# Altium schematic sheet Qunyin_mmWave_mainIOs.SchDoc: mmWave_iwr6843aop
size 457 x 292 mm; DrawnBy: Wxd; Organization: Shanghai Qunyin; Address1: Xianxia Rd 601; Address2: Changning district; Address3: Shanghai; DocumentNumber: 1; SheetNumber: 1; SheetTotal: 5
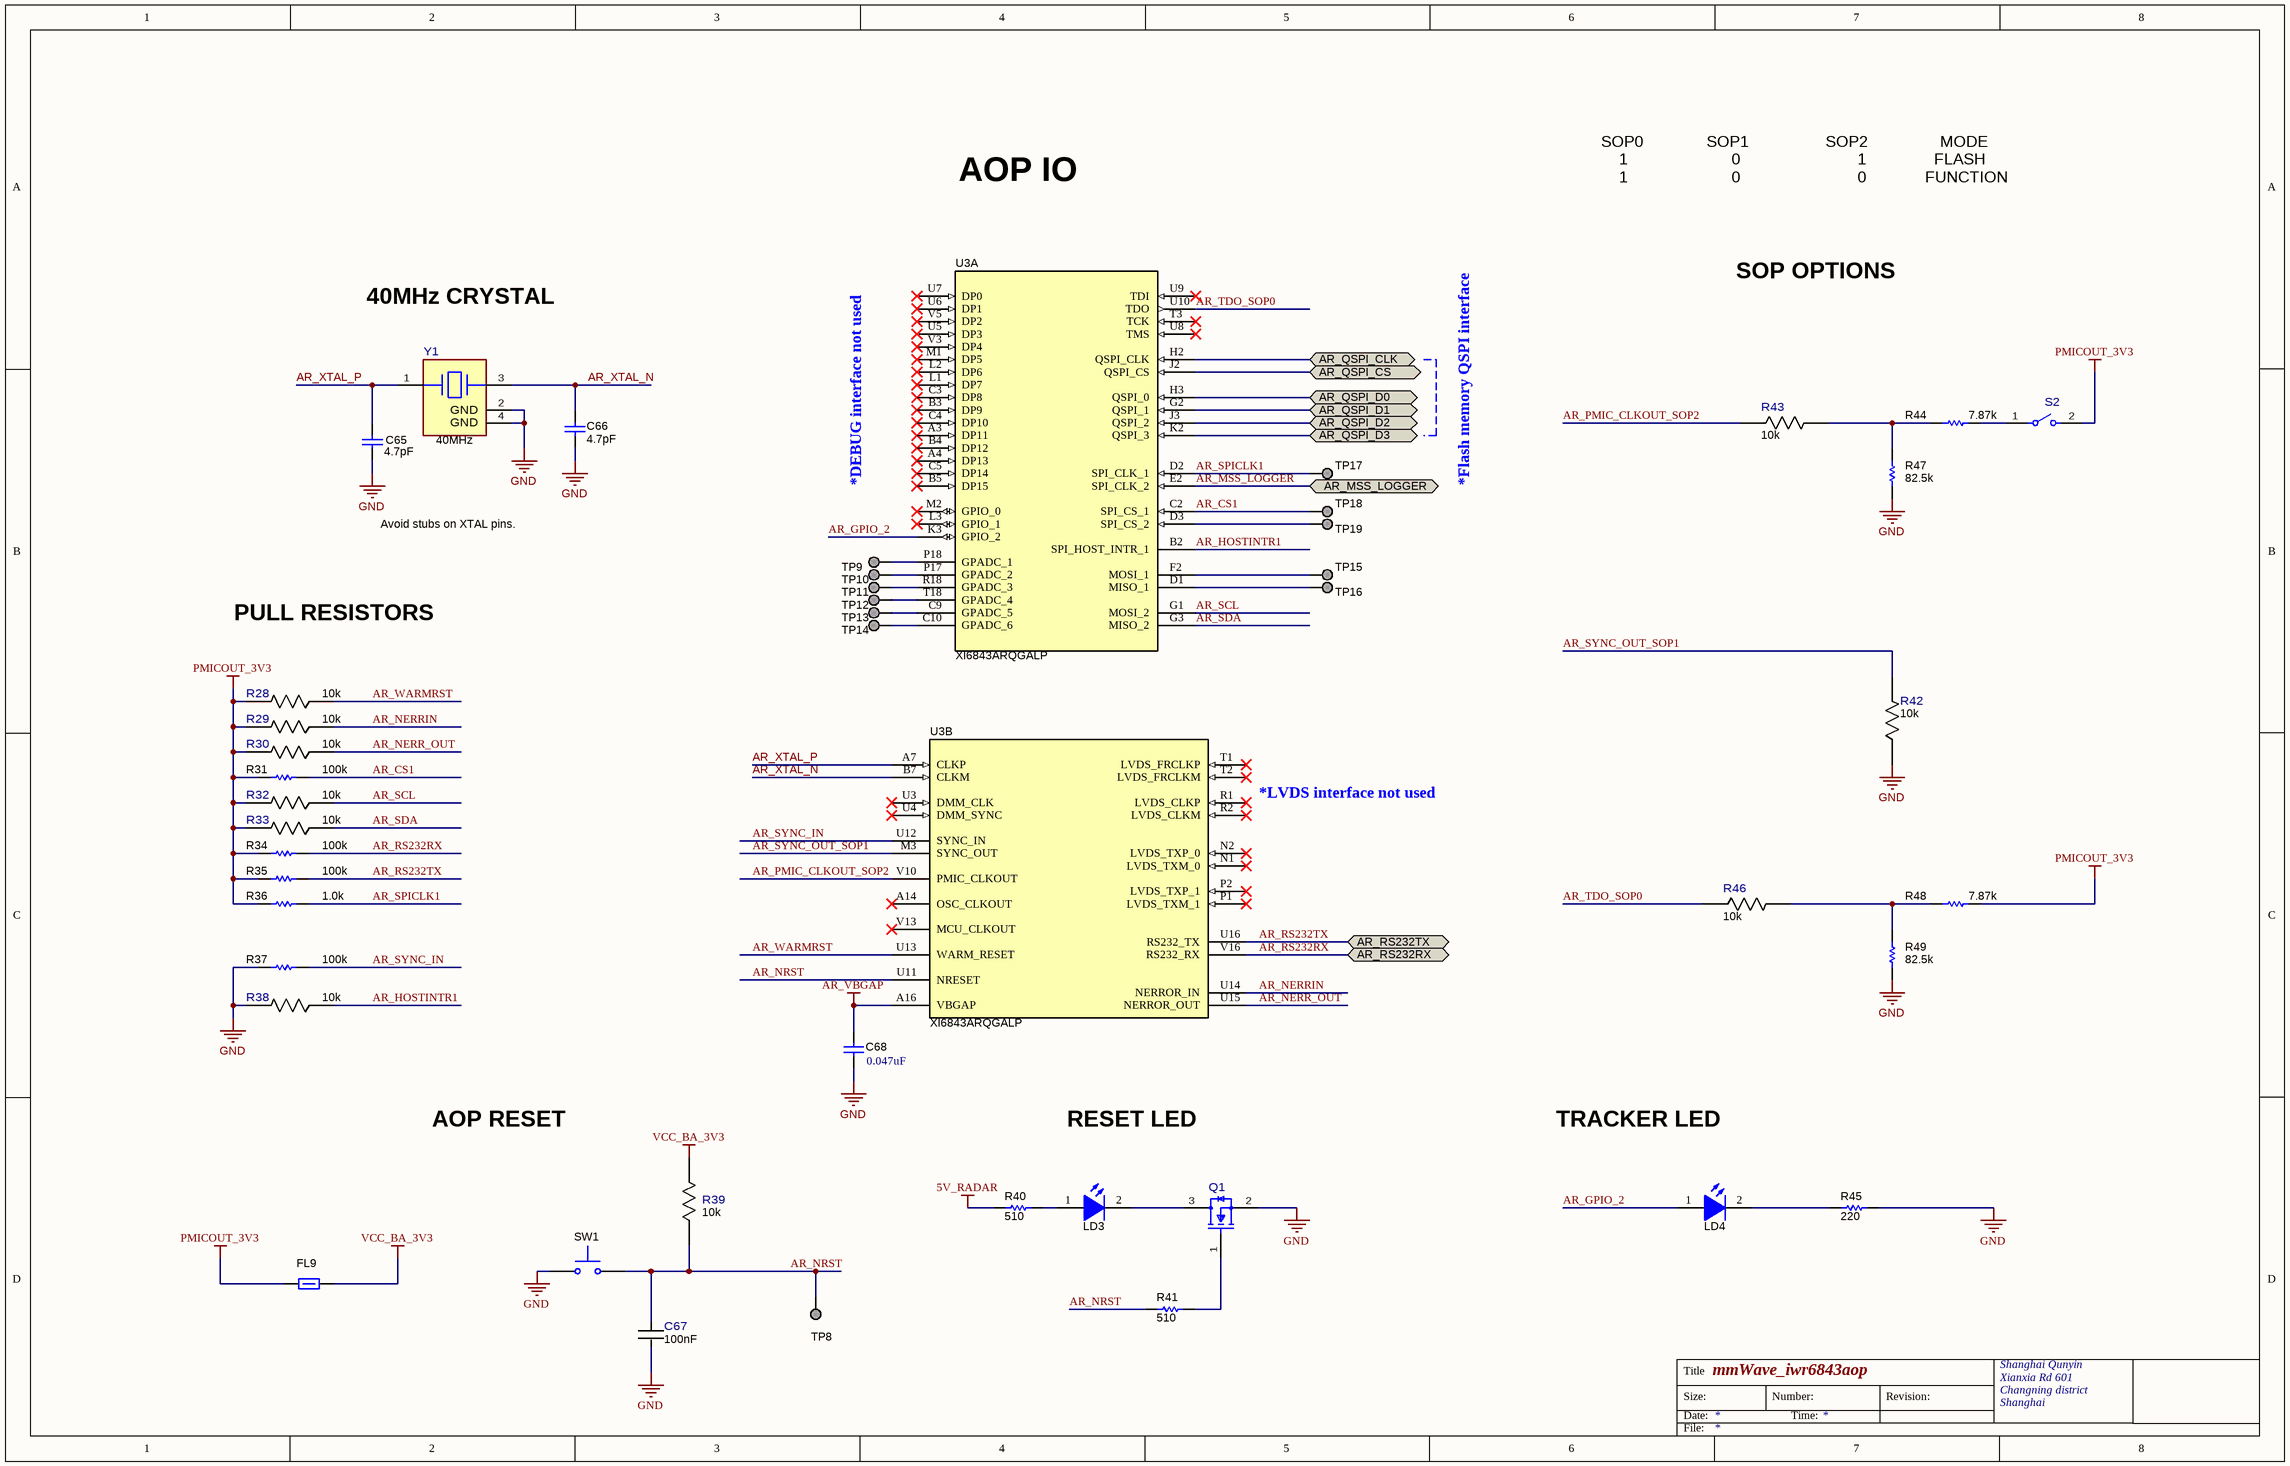
[diagram p0: Qunyin_mmWave_mainIOs.SchDoc]

## Parts
C65  value 4.7pF  [0201_033L]  (hidden comment: GRM0335C1H4R7BA01D)
C66  value 4.7pF  [0201_033L]  (hidden comment: GRM0335C1H4R7BA01D)
C67  Cap_F: 100nF  [FP-GRM033R6YA104KE14D_0201 (0603 Metric)-IPC_C]  (hidden comment: GRM033R6YA104KE14D)
C68  ValueDisplayed: 0.047uF  [0201_033L]  (hidden comment: GRM033R61C473KE84D)
FL9  BLM15PD300SZ1D  [0402L]  (value not drawn)
LD3  APHHS1005CGCK  [APHHS1005_Green]  (value not drawn)
LD4  APHHS1005CGCK  [APHHS1005_Green]  (value not drawn)
Q1  BSS123-7-F  [FP-BSS123-7-F_SOT23-IPC_C]  (value not drawn)
R28  Res_ohm: 10k  [FP-RR0306P-103-D_0201-IPC_C]  (hidden comment: RR0306P-103-D)
R29  Res_ohm: 10k  [FP-RR0306P-103-D_0201-IPC_C]  (hidden comment: RR0306P-103-D)
R30  Res_ohm: 10k  [FP-RR0306P-103-D_0201-IPC_C]  (hidden comment: RR0306P-103-D)
R31  value 100k  [0201L]  (hidden comment: CRCW0201100KFKED)
R32  Res_ohm: 10k  [FP-RR0306P-103-D_0201-IPC_C]  (hidden comment: RR0306P-103-D)
R33  Res_ohm: 10k  [FP-RR0306P-103-D_0201-IPC_C]  (hidden comment: RR0306P-103-D)
R34  value 100k  [0201L]  (hidden comment: CRCW0201100KFKED)
R35  value 100k  [0201L]  (hidden comment: CRCW0201100KFKED)
R36  value 1.0k  [0201L]  (hidden comment: RC0201JR-071KL)
R37  value 100k  [0201L]  (hidden comment: CRCW0201100KFKED)
R38  Res_ohm: 10k  [FP-RR0306P-103-D_0201-IPC_C]  (hidden comment: RR0306P-103-D)
R39  Res_ohm: 10k  [FP-RR0306P-103-D_0201-IPC_C]  (hidden comment: RR0306P-103-D)
R40  value 510  [0201L]  (hidden comment: RC0201JR-07510RL)
R41  value 510  [0201L]  (hidden comment: RC0201JR-07510RL)
R42  Res_ohm: 10k  [FP-RR0306P-103-D_0201-IPC_C]  (hidden comment: RR0306P-103-D)
R43  Res_ohm: 10k  [FP-RR0306P-103-D_0201-IPC_C]  (hidden comment: RR0306P-103-D)
R44  value 7.87k  [0201L]  (hidden comment: RC0201FR-077K87L)
R45  value 220  [0201L]  (hidden comment: RC0201JR-07220RL)
R46  Res_ohm: 10k  [FP-RR0306P-103-D_0201-IPC_C]  (hidden comment: RR0306P-103-D)
R47  value 82.5k  [0201L]  (hidden comment: RC0201FR-0782K5L)
R48  value 7.87k  [0201L]  (hidden comment: RC0201FR-077K87L)
R49  value 82.5k  [0201L]  (hidden comment: RC0201FR-0782K5L)
S2  CHS-01TA  [FP-CHS-01TA_SMT_SW_5MM4_2MM5-MFG]  (value not drawn)
SW1  B3U-1000P  [SW_B3U-1000P]  (value not drawn)
TP8  TESTPOINT  [TP_25MIL-SMT]  (value not drawn)  (no BOM)
TP9  TESTPOINT  [TP_25MIL-SMT]  (value not drawn)  (no BOM)
TP10  TESTPOINT  [TP_25MIL-SMT]  (value not drawn)  (no BOM)
TP11  TESTPOINT  [TP_25MIL-SMT]  (value not drawn)  (no BOM)
TP12  TESTPOINT  [TP_25MIL-SMT]  (value not drawn)  (no BOM)
TP13  TESTPOINT  [TP_25MIL-SMT]  (value not drawn)  (no BOM)
TP14  TESTPOINT  [TP_25MIL-SMT]  (value not drawn)  (no BOM)
TP15  TESTPOINT  [TP_25MIL-SMT]  (value not drawn)  (no BOM)
TP16  TESTPOINT  [TP_25MIL-SMT]  (value not drawn)  (no BOM)
TP17  TESTPOINT  [TP_25MIL-SMT]  (value not drawn)  (no BOM)
TP18  TESTPOINT  [TP_25MIL-SMT]  (value not drawn)  (no BOM)
TP19  TESTPOINT  [TP_25MIL-SMT]  (value not drawn)  (no BOM)
U3  XI6843ARQGALP  [ALP0180A]  (parts A,B of 4)
Y1  Frequency_Fixed: 40MHz  [FP-CX2016DB40000D0FLJCC_SMT_2MM0_1MM6-MFG]  (hidden comment: CX2016DB40000D0FLJCC)

## Ports
AR_MSS_LOGGER (bidir), AR_QSPI_CLK (bidir), AR_QSPI_CS (bidir), AR_QSPI_D0 (bidir), AR_QSPI_D1 (bidir), AR_QSPI_D2 (bidir), AR_QSPI_D3 (bidir), AR_RS232RX (bidir), AR_RS232TX (bidir)

## Nets
5V_RADAR: R40.1
AR_VBGAP: C68.1 U3.A16(VBGAP)
GND: C65.1 C66.1 C67.2 C68.2 Q1.2(S) R37.1 R38.2 R42.1 R45.1 R47.1 R49.1 SW1.2 Y1.2(GND) Y1.4(GND)
PMICOUT_3V3: FL9.1 R28.2 R29.2 R30.2 R31.1 R32.2 R33.2 R34.1 R35.1 R36.1 R48.1 S2.2
VCC_BA_3V3: FL9.2 R39.2
AR_CS1: R31.2 TP18.1 U3.C2(SPI_CS_1)
AR_GPIO_2: LD4.1(A) U3.K3(GPIO_2)
AR_HOSTINTR1: R38.1 U3.B2(SPI_HOST_INTR_1)
AR_MSS_LOGGER: U3.E2(SPI_CLK_2) ; port AR_MSS_LOGGER
AR_NERR_OUT: R30.1 U3.U15(NERROR_OUT)
AR_NERRIN: R29.1 U3.U14(NERROR_IN)
AR_NRST: C67.1 R39.1 R41.1 SW1.1 TP8.1 U3.U11(NRESET)
AR_PMIC_CLKOUT_SOP2: R43.1 U3.V10(PMIC_CLKOUT)
AR_QSPI_CLK: U3.H2(QSPI_CLK) ; port AR_QSPI_CLK
AR_QSPI_CS: U3.J2(QSPI_CS) ; port AR_QSPI_CS
AR_QSPI_D0: U3.H3(QSPI_0) ; port AR_QSPI_D0
AR_QSPI_D1: U3.G2(QSPI_1) ; port AR_QSPI_D1
AR_QSPI_D2: U3.J3(QSPI_2) ; port AR_QSPI_D2
AR_QSPI_D3: U3.K2(QSPI_3) ; port AR_QSPI_D3
AR_RS232RX: R34.2 U3.V16(RS232_RX) ; port AR_RS232RX
AR_RS232TX: R35.2 U3.U16(RS232_TX) ; port AR_RS232TX
AR_SCL: R32.1 U3.G1(MOSI_2)
AR_SDA: R33.1 U3.G3(MISO_2)
AR_SPICLK1: R36.2 TP17.1 U3.D2(SPI_CLK_1)
AR_SYNC_IN: R37.2 U3.U12(SYNC_IN)
AR_SYNC_OUT_SOP1: R42.2 U3.M3(SYNC_OUT)
AR_TDO_SOP0: R46.1 U3.U10(TDO)
AR_WARMRST: R28.1 U3.U13(WARM_RESET)
AR_XTAL_N: C66.2 U3.B7(CLKM) Y1.3
AR_XTAL_P: C65.2 U3.A7(CLKP) Y1.1
NetLD3_1: LD3.1(A) R40.2
NetLD3_2: LD3.2(K) Q1.3(D)
NetLD4_2: LD4.2(K) R45.2
NetQ1_1: Q1.1(G) R41.2
NetR43_2: R43.2 R44.2 R47.2
NetR44_1: R44.1 S2.1
NetR46_2: R46.2 R48.2 R49.2
NetTP9_1: TP9.1 U3.P18(GPADC_1)
NetTP10_1: TP10.1 U3.P17(GPADC_2)
NetTP11_1: TP11.1 U3.R18(GPADC_3)
NetTP12_1: TP12.1 U3.T18(GPADC_4)
NetTP13_1: TP13.1 U3.C9(GPADC_5)
NetTP14_1: TP14.1 U3.C10(GPADC_6)
NetTP15_1: TP15.1 U3.F2(MOSI_1)
NetTP16_1: TP16.1 U3.D1(MISO_1)
NetTP19_1: TP19.1 U3.D3(SPI_CS_2)

Not connected (* = marked no-connect by the designer): U3 A3(DP11)* A4(DP13)* A14(OSC_CLKOUT)* B3(DP9)* B4(DP12)* B5(DP15)* C3(DP8)* C4(DP10)* C5(DP14)* L1(DP7)* L2(DP6)* L3(GPIO_1)* M1(DP5)* M2(GPIO_0)* N1(LVDS_TXM_0)* N2(LVDS_TXP_0)* P1(LVDS_TXM_1)* P2(LVDS_TXP_1)* R1(LVDS_CLKP)* R2(LVDS_CLKM)* T1(LVDS_FRCLKP)* T2(LVDS_FRCLKM)* T3(TCK)* U3(DMM_CLK)* U4(DMM_SYNC)* U5(DP3)* U6(DP1)* U7(DP0)* U8(TMS)* U9(TDI)* V3(DP4)* V5(DP2)* V13(MCU_CLKOUT)*

## Notes on the sheet
- AOP IO
- SOP0              SOP1                 SOP2                MODE
  1                       0                          1               FLASH
  1                       0                          0             FUNCTION
- SOP OPTIONS
- 40MHz CRYSTAL
- Avoid stubs on XTAL pins.
- *DEBUG interface not used
- *Flash memory QSPI interface
- PULL RESISTORS
- *LVDS interface not used
- AOP RESET
- RESET LED
- TRACKER LED
- Title
- Size:
- Date:
- Number:
- Time:
- Revision:
- File:

## Library data of the parts
C65 C66 = CMP-0080076-1: CAP, CERM, 4.7 pF, 50 V,+/- 3%, C0G/NP0, 0201; Manufacturer: MuRata; AEC Category: Q200; AEC Qualified: N; Cap_Case: 0201; SizeArea_mm2: 0.18; SizeAreaWB_mm2: 2.08; SizeX_mm: 0.6; SizeY_mm: 0.3; SizeZ_mm: 0.33; TaMax_C: 125°C; TaMin_C: -55°C; U/M: EA; Value2: 50V; RoHS: Y; AEC Grade: N/A; Cap_F: 4.7pF; ComponentLink1Description: Datasheet link; ComponentLink1URL: https://search.murata.co.jp/Ceramy/image/img/A01X/G101/ENG/GRM0335C1H4R7BA01-01A.pdf; CompType: Capacitor; MountType: SMT; PackageReference: 0201; PartNumber: GRM0335C1H4R7BA01D; Polarized: N; Supplier 1: Digi-Key; Supplier 2: Mouser; Supplier Part Number 1: 490-11332-1-ND; Supplier Part Number 2: 81-GRM0335C1H4R7BA1D; Technology: Ceramic; TempCo: C0G/NP0; Tolerance_%: 3%; ValueDisplayed: 4.7pF; VDC_V: 50V
C67 = CMP-0086440-1: Cap Ceramic 0.1uF 35V X5R 10% Pad SMD 0201 85C T/R; Manufacturer: Murata Electronics North America; AEC Qualified: No; SizeZ_mm: 0.33mm; Symbol Name: SYM-GRM033R6YA104KE14D; TempCo: 15%; RoHS: TRUE; ComponentLink1Description: Datasheet; ComponentLink1URL: https://search.murata.co.jp/Ceramy/image/img/A01X/G101/ENG/GRM033R6YA104KE14-01.pdf; PackageReference: 0201 (0603 Metric); PartNumber: GRM033R6YA104KE14D; Tolerance_%: 10%; VDC_V: 35V
C68 = CMP-0009718-2: CAP, CERM, 0.047 uF, 16 V, +/- 10%, X5R, 0201; Manufacturer: MuRata; TaMin_C: -55°C; Polarized: N; SizeAreaWB_mm2: 2.08; Value1: Unknown; U/M: EA; TaMax_C: 85°C; SizeZ_mm: 0.33; SizeX_mm: 0.6; SizeY_mm: 0.3; Cap_Case: 0201; Value2: 16V; SizeArea_mm2: 0.18; Cap_F: 47nF; AEC Category: Q200; Supplier Part Number 2: 81-GRM033R61C473KE4D; Publisher: Texas Instruments; Supplier 2: Mouser; TempCo: X5R; Published: 2008-06-19; RoHS: Y; MountType: SMT; Value: 0.047uF; Supplier 1: Digi-Key; PackageReference: 0201; Tolerance_%: 10%; CompType: Capacitor; LatestRevisionDate: 2017-03-09; PartNumber: GRM033R61C473KE84D; AEC Qualified: N; VDC_V: 16V; ComponentLink1Description: Datasheet link; AEC Grade: N/A; Supplier Part Number 1: 490-7227-1-ND; Technology: Ceramic; ComponentLink1URL: http://search.murata.co.jp/Ceramy/image/img/A01X/G101/ENG/GRM033R61C473KE84-01.pdf
FL9 = CMP-0078934-1: Inductor, Ferrite Bead, Ferrite, 2.2 A, 0.035 ohm, AEC-Q200 Grade 1, SMD; Manufacturer: MuRata; AEC Category: Q200; AEC Grade: 1; AEC Qualified: Y; DCR_ohm: 0.035; Imax_A: 2.2A; SizeArea_mm2: 0.5; SizeAreaWB_mm2: 3; SizeZ_mm: 0.6; RoHS: Y; ComponentLink1Description: Datasheet link; ComponentLink1URL: https://www.murata.com/en-us/products/productdata/8796748677150/QNFA9118.pdf; CompType: Inductor; LatestRevisionDate: 2017-12-07; Material: Ferrite; MountType: SMT; PackageReference: 0402; PartNumber: BLM15PD300SZ1D; Published: 2008-06-26; Publisher: Texas Instruments; SizeX_mm: 1; SizeY_mm: 0.5; Supplier 1: Digi-Key; Supplier 2: Mouser; Supplier Part Number 1: 490-16506-1-ND; Supplier Part Number 2: 81-BLM15PD300SZ1D; Technology: Ferrite Bead; Value1: 0.035 ohm; Value2: 2.2A
LD3 LD4 = CMP-0067682-2: LED, Green, SMD; Manufacturer: Kingbright; Angle: 120.0; Power_TotalModule: 75mW; SizeZ_mm: 0.6; Vf_V: 2.1V; Vr_V: 5V; Io_A: 20mA; Ir_A: 10µA; SizeArea_mm2: 0.5; SizeAreaWB_mm2: 3.0; SizeX_mm: 1.0; Tjmax_C: 85°C; Value1: 0.075W; RoHS: Y; Color: Green; ComponentLink1Description: Datasheet link; ComponentLink1URL: http://www.kingbrightusa.com/images/catalog/SPEC/APHHS1005CGCK.pdf; PackageReference: 0402; PartNumber: APHHS1005CGCK; CompType: LED; MountType: SMT; SizeY_mm: 0.5; Type: ?; Value2: 2.1V; Value: Green
Q1 = CMP-0087176-1: MOSFET N-CH 100V 170MA SOT23-3; Manufacturer: Diodes Incorporated; AEC Qualified: No; ChMode: False; Rdson45_ohm: 6; SizeZ_mm: 1.1mm; Vgs_V: 20V; RoHS: TRUE; ComponentLink1Description: Datasheet; ComponentLink1URL: https://www.diodes.com/assets/Datasheets/ds30366.pdf; IdsMax_A: 170mA; PackageReference: SOT23; PartNumber: BSS123-7-F; Symbol Name: SYM-BSS123-7-F; VdsMax_V: 100V
R28-R30 R32 R33 R38 R39 R42 R43 R46 = CMP-0088002-1: 10 kOhms ±0.5% 0.05W, 1/20W Chip Resistor 0201 (0603 Metric)  Thin Film; Manufacturer: Susumu; AEC Qualified: No; Power_W: 50mW; SizeZ_mm: 0.26mm; Symbol Name: SYM-RR0306P-103-D; TempCo: 25ppm/°C; VDC_V: 15V; RoHS: TRUE; ComponentLink1Description: Datasheet; ComponentLink1URL: https://www.susumu.co.jp/common/pdf/n_catalog_partition05_en.pdf; PackageReference: 0201; PartNumber: RR0306P-103-D; Technology: Thin Film; Tolerance_%: 0.5%
R31 R34 R35 R37 = CMP-0027261-3: RES, 100 k, 1%, 0.05 W, 0201; Manufacturer: Vishay-Dale; AEC Category: Q200; AEC Qualified: N; EIA_Code: E96; Power_W: 50mW; SizeArea_mm2: 0.18; SizeX_mm: 0.6; SizeY_mm: 0.3; SizeZ_mm: 0.26; TempCo: 100 ppm/C; Value2: 0.05W; VDC_V: 30V; RoHS: E; AEC Grade: N/A; ComponentLink1Description: Datasheet link; ComponentLink1URL: http://www.vishay.com/docs/20052/crcw0201e3.pdf; CompType: Resistor; MountType: SMT; PackageReference: 0201; PartNumber: CRCW0201100KFKED; Res_ohm: 100k; Supplier 1: Digi-Key; Supplier 2: Newark; Supplier 3: Mouser; Supplier Part Number 1: 541-100KAABCT-ND; Supplier Part Number 2: 84R1457; Supplier Part Number 3: 71-CRCW0201100KFKED; Technology: Thick Film; Tolerance_%: 1%; Value1: 1%; Value_Code: 100k; ValueDisplayed: 100k
R36 = CMP-0027052-1: RES, 1.0 k, 5%, 0.05 W, 0201; Manufacturer: Yageo America; AEC Category: Q200; AEC Qualified: N; EIA_Code: E24; Power_W: 50mW; Res_ohm: 1k; SizeArea_mm2: 0.18; SizeX_mm: 0.6; SizeY_mm: 0.3; SizeZ_mm: 0.26; TempCo: 200 ppm/C; U/M: EA; Value2: 0.05W; Value_Code: 1k00; VDC_V: 25V; RoHS: Y; AEC Grade: N/A; ComponentLink1Description: Datasheet link; ComponentLink1URL: http://www.yageo.com/documents/recent/PYu-RC_Group_51_RoHS_L_5.pdf; CompType: Resistor; LatestRevisionDate: 2017-03-09; MountType: SMT; PackageReference: 0201; PartNumber: RC0201JR-071KL; Published: 2016-10-14; Publisher: Texas Instruments; Supplier 1: Digi-Key; Supplier 2: Mouser; Supplier Part Number 1: 311-1KNCT-ND; Supplier Part Number 2: 603-RC0201JR-071KL; Technology: Thick Film; Tolerance_%: 5%; Value1: 5%; ValueDisplayed: 1.0k
R40 R41 = CMP-0027137-1: RES, 510, 5%, 0.05 W, 0201; Manufacturer: Yageo America; AEC Category: Q200; AEC Qualified: N; EIA_Code: E24; Power_W: 50mW; SizeArea_mm2: 0.18; SizeX_mm: 0.6; SizeY_mm: 0.3; SizeZ_mm: 0.26; TempCo: 200 ppm/C; U/M: EA; Value2: 0.05W; Value_Code: 510R; VDC_V: 25V; RoHS: Y; AEC Grade: N/A; ComponentLink1Description: Datasheet link; ComponentLink1URL: http://www.yageo.com/documents/recent/PYu-RC_Group_51_RoHS_L_5.pdf; CompType: Resistor; LatestRevisionDate: 2017-03-09; MountType: SMT; PackageReference: 0201; PartNumber: RC0201JR-07510RL; Published: 2016-10-14; Publisher: Texas Instruments; Res_ohm: 510; Supplier 1: Digi-Key; Supplier 2: Mouser; Supplier Part Number 1: YAG2907CT-ND; Supplier Part Number 2: 603-RC0201JR-07510RL; Technology: Thick Film; Tolerance_%: 5%; Value1: 5%; ValueDisplayed: 510
R44 R48 = CMP-0027880-1: RES, 7.87 k, 1%, 0.05 W, 0201; Manufacturer: Yageo America; AEC Category: Q200; AEC Qualified: N; EIA_Code: E96; Power_W: 50mW; SizeArea_mm2: 0.18; SizeX_mm: 0.6; SizeY_mm: 0.3; SizeZ_mm: 0.26; TempCo: 200 ppm/C; U/M: EA; Value2: 0.05W; Value_Code: 7k87; VDC_V: 25V; RoHS: Y; AEC Grade: N/A; ComponentLink1Description: Datasheet link; ComponentLink1URL: http://www.yageo.com/documents/recent/PYu-RC_Group_51_RoHS_L_5.pdf; CompType: Resistor; LatestRevisionDate: 2017-03-09; MountType: SMT; PackageReference: 0201; PartNumber: RC0201FR-077K87L; Published: 2016-10-14; Publisher: Texas Instruments; Res_ohm: 7.87k; Supplier 1: Digi-Key; Supplier 2: Mouser; Supplier Part Number 1: YAG2807CT-ND; Supplier Part Number 2: 603-RC0201FR-077K87L; Technology: Thick Film; Tolerance_%: 1%; Value1: 1%; ValueDisplayed: 7.87k
R45 = CMP-0027072-1: RES, 220, 5%, 0.05 W, 0201; Manufacturer: Yageo America; AEC Category: Q200; AEC Qualified: N; EIA_Code: E24; Power_W: 50mW; SizeArea_mm2: 0.18; SizeX_mm: 0.6; SizeY_mm: 0.3; SizeZ_mm: 0.26; TempCo: 200 ppm/C; U/M: EA; Value2: 0.05W; Value_Code: 220R; VDC_V: 25V; RoHS: Y; AEC Grade: N/A; ComponentLink1Description: Datasheet link; ComponentLink1URL: http://www.yageo.com/documents/recent/PYu-RC_Group_51_RoHS_L_5.pdf; CompType: Resistor; LatestRevisionDate: 2017-03-09; MountType: SMT; PackageReference: 0201; PartNumber: RC0201JR-07220RL; Published: 2016-10-14; Publisher: Texas Instruments; Res_ohm: 220; Supplier 1: Digi-Key; Supplier 2: Mouser; Supplier Part Number 1: 311-220NCT-ND; Supplier Part Number 2: 603-RC0201JR-07220RL; Technology: Thick Film; Tolerance_%: 5%; Value1: 5%; ValueDisplayed: 220
R47 R49 = CMP-0027891-1: RES, 82.5 k, 1%, 0.05 W, 0201; Manufacturer: Yageo America; AEC Category: Q200; AEC Qualified: N; EIA_Code: E96; Power_W: 50mW; SizeArea_mm2: 0.18; SizeX_mm: 0.6; SizeY_mm: 0.3; SizeZ_mm: 0.26; TempCo: 200 ppm/C; U/M: EA; Value2: 0.05W; Value_Code: 82k5; VDC_V: 25V; RoHS: Y; AEC Grade: N/A; ComponentLink1Description: Datasheet link; ComponentLink1URL: http://www.yageo.com/documents/recent/PYu-RC_Group_51_RoHS_L_5.pdf; CompType: Resistor; LatestRevisionDate: 2017-03-09; MountType: SMT; PackageReference: 0201; PartNumber: RC0201FR-0782K5L; Published: 2016-10-14; Publisher: Texas Instruments; Res_ohm: 82.5k; Supplier 1: Digi-Key; Supplier 2: Mouser; Supplier Part Number 1: YAG2815CT-ND; Supplier Part Number 2: 603-RC0201FR-0782K5L; Technology: Thick Film; Tolerance_%: 1%; Value1: 1%; ValueDisplayed: 82.5k
S2 = CMP-0087181-1: SWITCH SLIDE DIP SPST 100MA 6V; Manufacturer: Nidec Copal Electronics; PositionCount: 1; SizeZ_mm: 2.5mm; Symbol Name: SYM-CHS-01TA; RoHS: TRUE; Circuit: SPST; ComponentLink1Description: Datasheet; ComponentLink1URL: https://www.nidec-copal-electronics.com/e/catalog/switch/chs.pdf; MountType: Surface Mount; PackageReference: SMT_SW_5MM4_2MM5; PartNumber: CHS-01TA; VDC_V: 6V
SW1 = CMP-0002150-2: SWITCH TACTILE SPST-NO 0.05A 12V; Manufacturer: Omron Electronic Components; CurrentRating_mA: 50A; PositionCount: 1; SwitchFunction: Off-Mom; RoHS: Y; Circuit: SPST-NO; ComponentLink1Description: Datasheet URL; ComponentLink1URL: http://www.components.omron.com/components/web/PDFLIB.nsf/0/2DD3893C7DD33E9E862572900079E9D6/$file/B3U_1110.pdf; CompType: Switch; LatestRevisionDate: 2017-03-09; MountType: SMT; Orientation: Top Actuated; PackageReference: 3x1.6x2.5mm; PartNumber: B3U-1000P; Publisher: Texas Instruments; Supplier 1: Digi-Key; Supplier 2: Newark; Supplier 3: Mouser; Supplier Part Number 1: SW1020CT-ND; Supplier Part Number 2: 34M5295; Supplier Part Number 3: 653-B3U-1000P; VDC_V: 12V
TP8-TP19 = CMP-0078143-3: TEST POINT.  No entry in BOM.; CompType: Testpoint; Manufacturer: N/A; PackageReference: N/A; PartNumber: N/A; Library Reference: TESTPOINT
U3 = CMP-0860942-2: XI6843ARQGALP, ALP0180A (BGA-180); Manufacturer: Texas Instruments; SizeZ_mm: 0.965; SizeX_mm: 15; AEC Qualified: N; SizeArea_mm2: 225; SizeAreaWB_mm2: 289; CompType: IC; AEC Category: Q200; MountType: SMT; ComponentLink2URL: http://www.ti.com/product/xi6843arqg; Alternate Manufacturer: Texas Instruments; ComponentLink2Description: Product Folder; ComponentLink3Description: Online Datasheet; PackageReference: ALP0180A; ComponentLink1URL: http://www.ti.com/lit/ds/symlink/xi6843arqg.pdf; PartNumber: XI6843ARQGALP; PackageDescription: BGA-180; ComponentLink1Description: Datasheet Link; ComponentLink3URL: http://www.ti.com/product/xi6843arqg/datasheet; SizeY_mm: 15
Y1 = CMP-0087164-1: CRYSTAL 40.0000MHZ 8PF SMD; Manufacturer: Kyocera International Inc. Electronic Components; AEC Qualified: No; Frequency Stability: 15ppm; SizeZ_mm: 0.45mm; RoHS: TRUE; ComponentLink1Description: Datasheet; ComponentLink1URL: https://global.kyocera.com/prdct/electro/product/pdf/cx2016db_e.pdf; Frequency Tolerance: 15ppm; Load Capacitance: 8pF; PackageReference: SMT_2MM0_1MM6; PartNumber: CX2016DB40000D0FLJCC; Symbol Name: SYM-CX2016DB40000D0FLJCC